# Altium schematic sheet 555 Timer.SchDoc: PCB Workshop
size A4; Revision: 1.1; SheetNumber: 1; SheetTotal: 1; Designer: Martin B; Project: PSAT; Design Name: 555 Timer; BoardRevision: 1.1; DesignName: 555 Timer
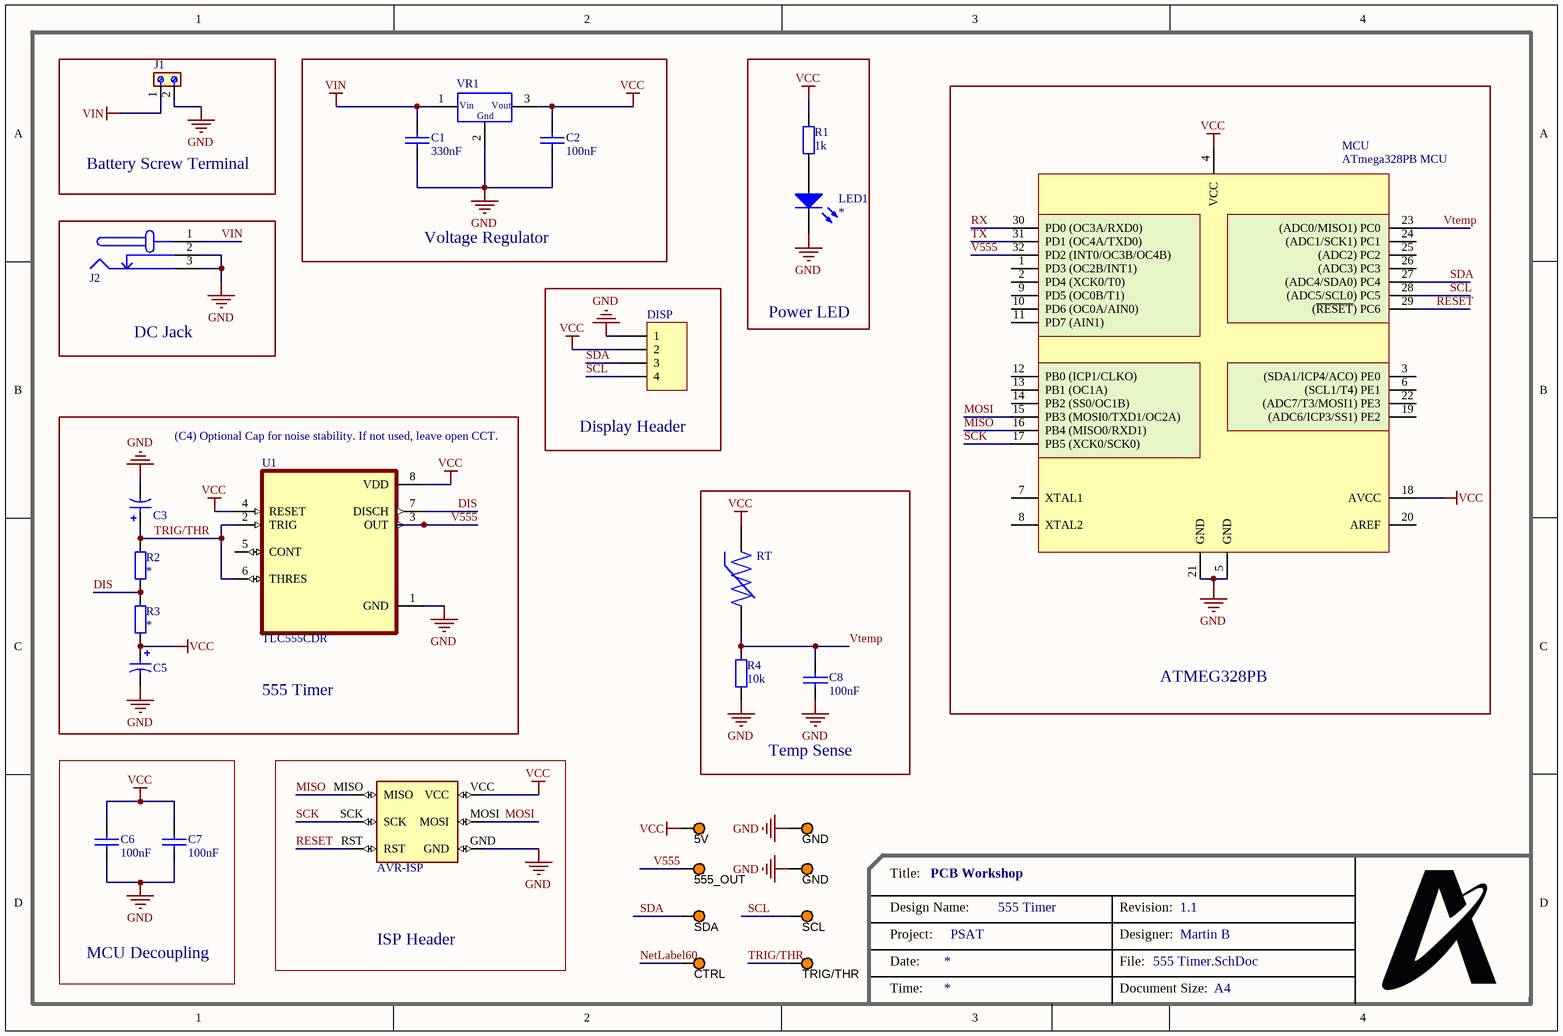
[diagram p0: 555 Timer.SchDoc]

## Parts
(Parts that share a designator on the sheet are numbered #1, #2 ... from top to bottom, then left to right.)
5V  5003  [TP_TH]  (value not drawn)
555_OUT  5003  [TP_TH]  (value not drawn)
?  AVR-ISP  [AVR-ISP]
C1  330nF  [0805 CAP]
C2  100nF  [0805 CAP]
C3  *  [CAP POL 8x5.4mm SMT]  (value not drawn)
C5  10nF  [CAP POL 8x5.4mm SMT]  (value not drawn)
C6  100nF  [0805 CAP]
C7  100nF  [0805 CAP]
C8  100nF  [0805 CAP]
CTRL  5003  [TP_TH]  (value not drawn)
DISP  Header 4  [ece-HDR1X4]  (value not drawn)
GND#1  5003  [TP_TH]  (value not drawn)
GND#2  5003  [TP_TH]  (value not drawn)
J1  (no value)  [691213510002]
J2  DC barrel jack  [AC-Socket]  (value not drawn)
LED1  *  [ECE-LED2012-0805SM]
MCU  ATmega328PB MCU  [32 - TQFP]
R1  1k  [RESC2012-0805SM]
R2  *  [0805 RES]
R3  *  [0805 RES]
R4  10k  [0805 RES]
RT  NCP15XH103F03RC  [THRMC1005X55N]  (value not drawn)
SCL  5003  [TP_TH]  (value not drawn)
SDA  5003  [TP_TH]  (value not drawn)
TRIG/THR  5003  [TP_TH]  (value not drawn)
U1  TLC555CDR  [SOIC127P599X175-8N]
VR1  (no value)  [ece-TO220]

## Blocks framed on the sheet
Battery Screw Terminal: J1
Voltage Regulator: C1 C2 VR1
Power LED: LED1 R1
ATMEG328PB: MCU
DC Jack: J2
Display Header: DISP
555 Timer: C3 C5 R2 R3 U1
Temp Sense: C8 R4 RT
MCU Decoupling: C6 C7
ISP Header: ?

## Nets
GND: ?.GND C1.2 C2.2 C3.2 C5.2 C6.2 C7.2 C8.2 DISP.1 GND#1.1 GND#2.1 J1.2 J2.2(GND_ALT) J2.3(GND) LED1.2(K) MCU.5(GND) MCU.21(GND) R4.1 U1.1(GND) VR1.2(Gnd)
VCC: 5V.1 ?.VCC C2.1 C5.1 C6.1 C7.1 DISP.2 MCU.4(VCC) MCU.18(AVCC) R1.1 R3.1 RT.1 U1.4(RESET) U1.8(VDD) VR1.3(Vout)
VIN: C1.1 J1.1 J2.1(VCC) VR1.1(Vin)
DIS: R2.1 R3.2 U1.7(DISCH)
MISO: ?.MISO MCU.16(PB4_(MISO0/RXD1))
MOSI: ?.MOSI MCU.15(PB3_(MOSI0/TXD1/OC2A))
NetLabel60: CTRL.1
RESET: ?.RST MCU.29((~{RESET})_PC6)
RX: MCU.30(PD0_(OC3A/RXD0))
SCK: ?.SCK MCU.17(PB5_(XCK0/SCK0))
SCL: DISP.4 MCU.28((ADC5/SCL0)_PC5) SCL.1
SDA: DISP.3 MCU.27((ADC4/SDA0)_PC4) SDA.1
TRIG/THR: C3.1 R2.2 TRIG/THR.1 U1.2(TRIG) U1.6(THRES)
TX: MCU.31(PD1_(OC4A/TXD0))
V555: 555_OUT.1 MCU.32(PD2_(INT0/OC3B/OC4B)) U1.3(OUT)
Vtemp: C8.1 MCU.23((ADC0/MISO1)_PC0) R4.2 RT.2
NetLED1_1: LED1.1(A) R1.2

Not connected (* = marked no-connect by the designer): MCU 1(PD3_(OC2B/INT1)) 2(PD4_(XCK0/T0)) 3((SDA1/ICP4/ACO)_PE0) 6((SCL1/T4)_PE1) 7(XTAL1) 8(XTAL2) 9(PD5_(OC0B/T1)) 10(PD6_(OC0A/AIN0)) 11(PD7_(AIN1)) 12(PB0_(ICP1/CLKO)) 13(PB1_(OC1A)) 14(PB2_(SS0/OC1B)) 19((ADC6/ICP3/SS1)_PE2) 20(AREF) 22((ADC7/T3/MOSI1)_PE3) 24((ADC1/SCK1)_PC1) 25((ADC2)_PC2) 26((ADC3)_PC3); U1 5(CONT)

## Notes on the sheet
- (C4) Optional Cap for noise stability. If not used, leave open CCT.
- Title:
- Design Name:
- Revision:
- Project:
- Date:
- Designer:
- File:
- Time:
- Document Size:
- A4

## Library data of the parts
5V 555_OUT CTRL GND#1 GND#2 SCL SDA TRIG/THR = TestPoint: Test Point, Orange, 1-Pin THD, RoHS; Peak Reverse Current: 600 uA; Forward Current: 3 A; Max Surge Current: 80 A; Forward Voltage: 1.08 V; Max Operating Temperature: 150 degC; PackageReference: 5003; Pins: 2; ComponentLink2URL: http://keyelco.com/userAssets/file/M65p56.pdf; PackageDescription: 1-Pin Through Hole Device, Dia 2.54 mm; Weight: 0.01 lb; Diameter: 5.3 mm; Mount: Through Hole; Package Quantity: 500; Packaging: Bulk; Min Operating Temperature: -65 degC; ComponentLink1Description: Manufacturer URL; Height: 0.25 inch; ComponentLink1URL: http://www.keyelco.com/; ComponentLink2Description: Datasheet; Width: 0.25 inch; REACH SVHC: No SVHC; RoHSCompliant: true; Radiation Hardening: No; Length: 9.5 mm; DatasheetVersion: Jun-15
? = CMP-036-000000-1: Emulators / Simulators AVR USB IN CIRCUIT EMUL/PRGMR ISP; MF: Gravitech; Package: None; MP: AVR-ISP; Pin Count: 6; Source: SnapEDAsch.SchLib; Availability: Unavailable; Component Type: Standard; SnapEDA_Link: https://www.snapeda.com/parts/AVR-ISP/Gravitech/view-part/4593377/?ref=snap; Design Item ID: AVR-ISP; Price: None; Value: *
C1 C2 C6-C8 = CerCap_SMT_0805: SMT ceramic capacitor 0805 size; Value: *
C3 C5 = ElecCap_SMT_8D0: CAP ALUM 22UF 20% 50V SMD (Model: UWX1H220MCL1GB); Manufacturer: Nichicon; Manufacturer Part Number: UWX1V220MCL1GB; Lifetime @ Temp.: 2000 Hrs @ 85°C; Polarization: Polar; Surface Mount Land Size: 0.260" L x 0.260" W (6.60mm x 6.60mm); Capacitance 1: 22 µF; Revision: July-2002: Re-released for DXP Platform.; RoHS: RoHS Compliant; Category: Capacitors; Stock 1: 680; Pricing 1: 1=0.59, 10=0.406, 100=0.2304, 500=0.16268 (NZD); Packaging: Cut Tape (CT); Part Status: Active; Tolerance: ±20%; ESR (Equivalent Series Resistance): -; Operating Temperature: -40°C ~ 85°C; Ratings: -; Applications: General Purpose; Lead Spacing: -; Size / Dimension: 0.248" Dia (6.30mm); Height - Seated (Max): 0.213" (5.40mm); Mounting Type: Surface Mount; Package / Case: Radial, Can - SMD; ComponentLink1URL: http://nichicon-us.com/english/products/pdfs/e-uwx.pdf; ComponentLink1Description: http://nichicon-us.com/english/products/pdfs/e-uwx.pdf; Supplier 1: Digi-Key; Supplier Part Number 1: 493-2136-1-ND; Value: *
DISP = Header 4: Header, 4-Pin; LatestRevisionDate: 17-Jul-2002; LatestRevisionNote: Re-released for DXP Platform.; Publisher: Altium Limited
J1 = CMP-014-000000-1: 2 Position Wire to Board Terminal Block Horizontal with Board 0.200 (5.08mm) Through Hole; MF: WÃ¼rth Elektronik; Pin Count: 2; Value: *; SnapEDA_Link: https://www.snapeda.com/parts/691213510002/W%25C3%25BCrth+Elektronik+Midcom/view-part/?ref=snap; Package: None; Check_prices: https://www.snapeda.com/parts/691213510002/W%25C3%25BCrth+Elektronik+Midcom/view-part/?ref=eda; Component Type: Standard; Design Item ID: 691213510002; MP: 691213510002; Source: 691213510002.SchLib
J2 = AC_Input: DC barrel jack connection to AC source; Value: socket
LED1 = LED-SM0805: SMT LED; Manufacturer: Generic Components; Class I: Optoelectronic; Published: 8-Jun-2000; Revision: July-2002: Re-released for DXP Platform.; Publisher: Altium Limited; Class II: LED; Value: *
MCU = ATmega328PB_SMT_TQFP32: IC MCU 8BIT 32KB FLASH 32TQFP; Manufacturer: Atmel; Manufacturer Part Number: ATMEGA328PB-AN; Core Processor: AVR; Core Size: 8-Bit; Speed: 20MHz; Connectivity: I²C, SPI, UART/USART; Peripherals: Brown-out Detect/Reset, POR, PWM, WDT; Number of I/O: 27; Program Memory Size: 32KB (16K x 16); EEPROM Size: 1K x 8; RAM Size: 2K x 8; Voltage - Supply (Vcc/Vdd): 1.8 V ~ 5.5 V; Data Converters: A/D 8x10b; Oscillator Type: Internal; Supplier 1: Digi-Key; RoHS: RoHS Compliant; Category: Integrated Circuits (ICs); Stock 1: 366; Pricing 1: 1=2.74, 10=2.448, 25=2.2032, 100=2.0074, 250=1.81152, 500=1.62548, 1000=1.37088 (USD); Packaging: Tray; Part Status: Active; Program Memory Type: FLASH; Operating Temperature: -40°C ~ 105°C (TA); Package / Case: 32-TQFP; Supplier Device Package: 32-TQFP (7x7); ComponentLink1URL: http://www.atmel.com/images/atmel-42397-8-bit-avr-microcontroller-atmega328pb_datasheet.pdf; ComponentLink1Description: http://www.atmel.com/images/atmel-42397-8-bit-avr-microcontroller-atmega328pb_datasheet.pdf
R1 = Res SM 0805: SM resistor; Value: *
R2-R4 = Res_SMT_0805: 0805 resistor; Published: 8-Jun-2000; LatestRevisionDate: 17-Jul-2002; LatestRevisionNote: Re-released for DXP Platform.; PackageReference: AXIAL-0.4; Publisher: Altium Limited; Value: *; ComponentLink1Description: https://nz.mouser.com/datasheet/2/315/AOA0000C304-1149620.pdf
RT = CMP-041-000000-1: NTC Thermistor 10k 0402 (1005 Metric); MF: Murata; SnapEDA_Link: https://www.snapeda.com/parts/NCP15XH103F03RC/Murata/view-part/?ref=snap; Design Item ID: NCP15XH103F03RC; Source: NCP15XH103F03RC.SchLib; Package: 1005 Taiyo Yuden; MP: NCP15XH103F03RC; Check_prices: https://www.snapeda.com/parts/NCP15XH103F03RC/Murata/view-part/?ref=eda; Value: *
U1 = CMP-043-000000-1: 2.1-MHz, 250-ÂµA, Low-Power Timer; MF: Texas Instruments; Package: SOIC-8 Texas Instruments; Check_prices: https://www.snapeda.com/parts/TLC555CDR/Texas+Instruments/view-part/?ref=eda; Source: TLC555CDR.SchLib; Design Item ID: TLC555CDR; MP: TLC555CDR; Value: *; SnapEDA_Link: https://www.snapeda.com/parts/TLC555CDR/Texas+Instruments/view-part/?ref=snap
VR1 = VoltRegBig: Voltage Regulator; Value: *